# Altium schematic sheet Host.SchDoc
size A4; SheetNumber: 6; SheetTotal: 8
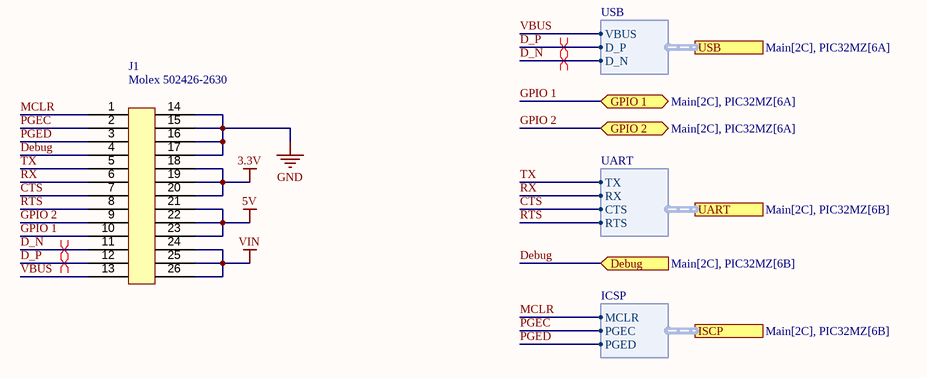
[diagram p0: Host.SchDoc]

## Parts
J1  Molex 502426-2630  [Molex 502426-2630]

## Ports
Debug (in, see Main[2C], PIC32MZ[6B]), GPIO 1 (bidir, see Main[2C], PIC32MZ[6A]), GPIO 2 (bidir, see Main[2C], PIC32MZ[6A]), ISCP (harness ICSP, see Main[2C], PIC32MZ[6B]), UART (harness UART, see Main[2C], PIC32MZ[6B]), USB (harness USB, see Main[2C], PIC32MZ[6A])

## Harnesses
UART: TX, RX, CTS, RTS
USB: VBUS, D_P, D_N
ICSP: MCLR, PGEC, PGED

## Nets
3.3V: J1.18 J1.19 J1.20
5V: J1.21 J1.22 J1.23
GND: J1.14 J1.15 J1.16 J1.17
VIN: J1.24 J1.25 J1.26
CTS: J1.7 ; port UART.CTS
D_N: J1.11 ; port USB.D_N
D_P: J1.12 ; port USB.D_P
Debug: J1.4 ; port Debug
GPIO 1: J1.10 ; port GPIO 1
GPIO 2: J1.9 ; port GPIO 2
MCLR: J1.1 ; port ISCP.MCLR
PGEC: J1.2 ; port ISCP.PGEC
PGED: J1.3 ; port ISCP.PGED
RTS: J1.8 ; port UART.RTS
RX: J1.6 ; port UART.RX
TX: J1.5 ; port UART.TX
VBUS: J1.13 ; port USB.VBUS

## Layout directives
differential pair: D_N, D_P

## Notes on the sheet
- TITLE
- SIZE
- A4
- VARIANT
- PROJECT
- SHEET
- VERSION
- OF
- AUTHOR
- DATE